# EAGLE schematic JunoCTRL Current (EAGLE 9.2.2)
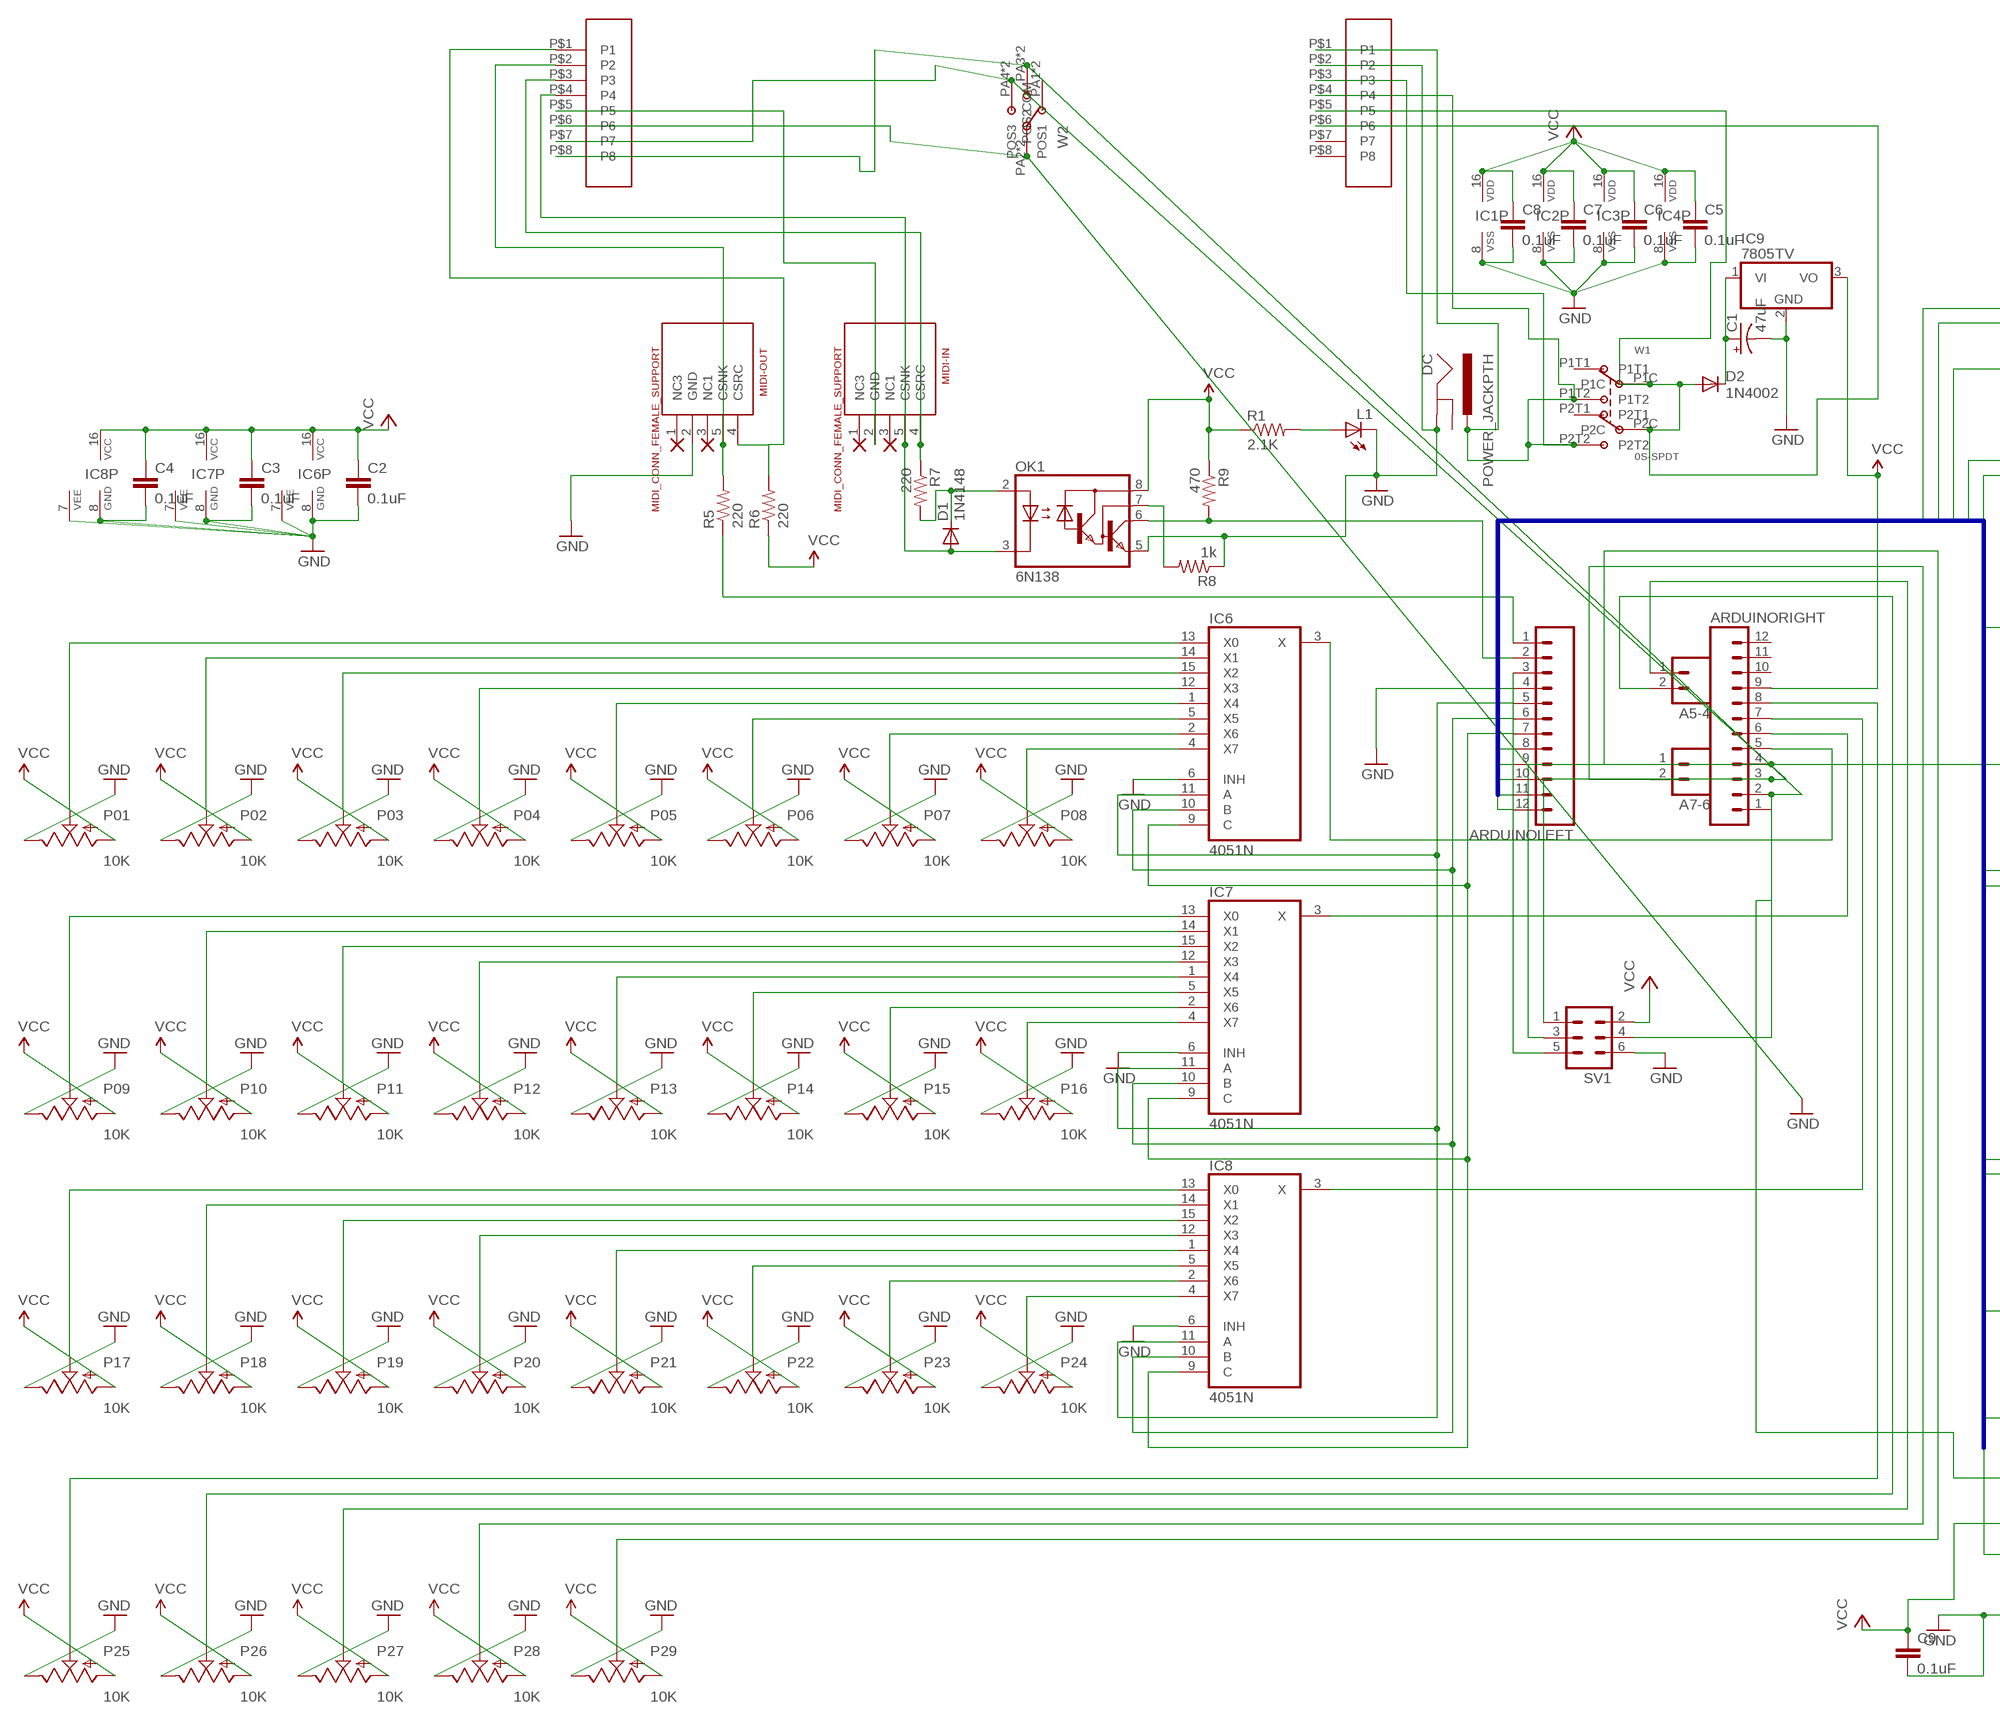
[diagram p0: schematic, sheet 1, part 1 of 2]
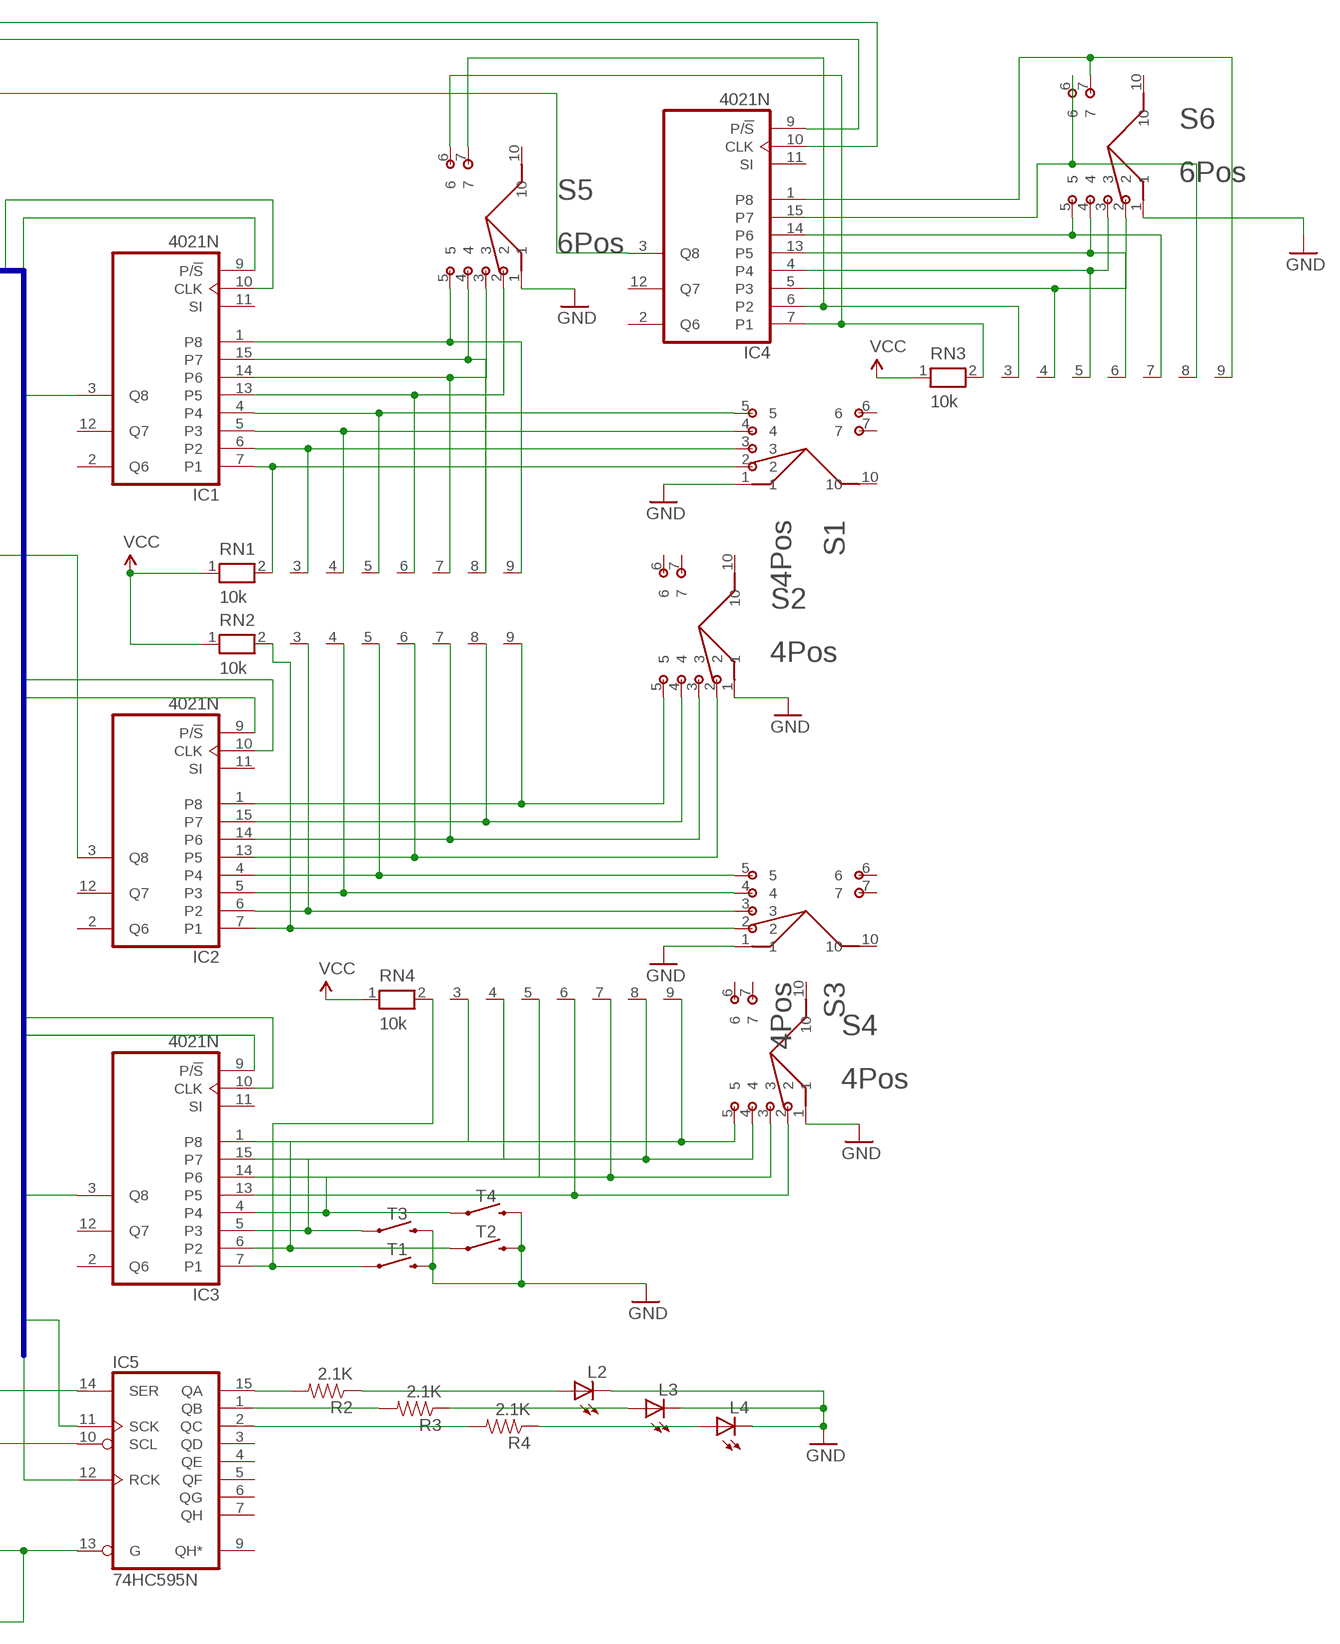
[diagram p1: schematic, sheet 1, part 2 of 2]

## Parts
A5-4  M02PTH  [1X02]
A7-6  M02PTH  [1X02]
ARDUINOLEFT  M12PTH  [1X12]
ARDUINORIGHT  M12PTH  [1X12]
C1  47uF  CAP_POLPTH1  [CPOL-RADIAL-100UF-25V]
C2  0.1uF  CAPPTH  [CAP-PTH-SMALL]
C3  0.1uF  CAPPTH  [CAP-PTH-SMALL]
C4  0.1uF  CAPPTH  [CAP-PTH-SMALL]
C5  0.1uF  CAPPTH  [CAP-PTH-SMALL]
C6  0.1uF  CAPPTH  [CAP-PTH-SMALL]
C7  0.1uF  CAPPTH  [CAP-PTH-SMALL]
C8  0.1uF  CAPPTH  [CAP-PTH-SMALL]
C9  0.1uF  CAPPTH  [CAP-PTH-SMALL]
D1  1N4148  1N4148DO35-7  [DO35-7]
D2  1N4002  1N4004  [DO41-7]
DC  POWER_JACKPTH  [POWER_JACK_PTH]
IC1  4021N  [DIL16]
IC2  4021N  [DIL16]
IC3  4021N  [DIL16]
IC4  4021N  [DIL16]
IC5  74HC595N  [DIL16]
IC6  4051N  [DIL16]
IC7  4051N  [DIL16]
IC8  4051N  [DIL16]
IC9  7805TV  [TO220V]
L1  LED3MM  [LED3MM]
L2  LED3MM  [LED3MM]
L3  LED3MM  [LED3MM]
L4  LED3MM  [LED3MM]
MIDI-IN  MIDI_CONN_FEMALE_SUPPORT  [DIN_5_FEMALE_SUPPORT]
MIDI-OUT  MIDI_CONN_FEMALE_SUPPORT  [DIN_5_FEMALE_SUPPORT]
OK1  6N138  [DIL08]
P01  10K  POT  [ALPS_POT]
P02  10K  POT  [ALPS_POT]
P03  10K  POT  [ALPS_POT]
P04  10K  POT  [ALPS_POT]
P05  10K  POT  [ALPS_POT]
P06  10K  POT  [ALPS_POT]
P07  10K  POT  [ALPS_POT]
P08  10K  POT  [ALPS_POT]
P09  10K  POT  [ALPS_POT]
P10  10K  POT  [ALPS_POT]
P11  10K  POT  [ALPS_POT]
P12  10K  POT  [ALPS_POT]
P13  10K  POT  [ALPS_POT]
P14  10K  POT  [ALPS_POT]
P15  10K  POT  [ALPS_POT]
P16  10K  POT  [ALPS_POT]
P17  10K  POT  [ALPS_POT]
P18  10K  POT  [ALPS_POT]
P19  10K  POT  [ALPS_POT]
P20  10K  POT  [ALPS_POT]
P21  10K  POT  [ALPS_POT]
P22  10K  POT  [ALPS_POT]
P23  10K  POT  [ALPS_POT]
P24  10K  POT  [ALPS_POT]
P25  10K  POT  [ALPS_POT]
P26  10K  POT  [ALPS_POT]
P27  10K  POT  [ALPS_POT]
P28  10K  POT  [ALPS_POT]
P29  10K  POT  [ALPS_POT]
R1  2.1K  RESISTORAXIAL-0.3  [AXIAL-0.3]
R2  2.1K  RESISTORAXIAL-0.3  [AXIAL-0.3]
R3  2.1K  RESISTORAXIAL-0.3  [AXIAL-0.3]
R4  2.1K  RESISTORAXIAL-0.3  [AXIAL-0.3]
R5  220  RESISTORAXIAL-0.3  [AXIAL-0.3]
R6  220  RESISTORAXIAL-0.3  [AXIAL-0.3]
R7  220  RESISTORAXIAL-0.3  [AXIAL-0.3]
R8  1k  RESISTORAXIAL-0.3  [AXIAL-0.3]
R9  470  RESISTORAXIAL-0.3  [AXIAL-0.3]
RN1  10k  RN08  [RN-9]
RN2  10k  RN08  [RN-9]
RN3  10k  RN08  [RN-9]
RN4  10k  RN08  [RN-9]
S1  4Pos  SRBV  [SRBV]
S2  4Pos  SRBV  [SRBV]
S3  4Pos  SRBV  [SRBV]
S4  4Pos  SRBV  [SRBV]
S5  6Pos  SRBV  [SRBV]
S6  6Pos  SRBV  [SRBV]
SV1  MA03-2  [MA03-2]
T1  TACTSWITCH  [TACTILE-PTH-12MM]
T2  TACTSWITCH  [TACTILE-PTH-12MM]
T3  TACTSWITCH  [TACTILE-PTH-12MM]
T4  TACTSWITCH  [TACTILE-PTH-12MM]
U$1  JSTCUSTOM_JST_PH8THROUGH_HOLE  [JSTCUSTOM_JST_PH8]
U$2  JSTCUSTOM_JST_PH8THROUGH_HOLE  [JSTCUSTOM_JST_PH8]
W1  0S-SPDT  [0S-SPDT]
W2  0S-SP3T  [0S-SP3T]

## Nets
GND: ARDUINOLEFT.4 C1.2(-) C2.2 C3.2 C4.2 C5.2 C6.2 C7.2 C8.2 C9.2 DC.GND IC1.8(VSS) IC2.8(VSS) IC3.8(VSS) IC4.8(VSS) IC5.13(G) IC6.6(INH) IC6.7(VEE) IC6.8(GND) IC7.6(INH) IC7.7(VEE) IC7.8(GND) IC8.6(INH) IC8.7(VEE) IC8.8(GND) IC9.2(GND) L1.K(C) L2.K(C) L3.K(C) L4.K(C) MIDI-OUT.2(GND) OK1.5(GND) P01.P$1(E) P02.P$1(E) P03.P$1(E) P04.P$1(E) P05.P$1(E) P06.P$1(E) P07.P$1(E) P08.P$1(E) P09.P$1(E) P10.P$1(E) P11.P$1(E) P12.P$1(E) P13.P$1(E) P14.P$1(E) P15.P$1(E) P16.P$1(E) P17.P$1(E) P18.P$1(E) P19.P$1(E) P20.P$1(E) P21.P$1(E) P22.P$1(E) P23.P$1(E) P24.P$1(E) P25.P$1(E) P26.P$1(E) P27.P$1(E) P28.P$1(E) P29.P$1(E) R8.P$1 S1.1 S2.1 S3.1 S4.1 S5.1 S6.1 SV1.6 T1.1 T2.1 T3.1 T4.1 U$1.P$6(P6) U$2.P$2(P2) W2.PA2(COM) W2.PA6(COM)
N$1: IC7.4(X7) P16.P$2(S)
N$2: IC6.4(X7) P08.P$2(S)
N$3: IC6.2(X6) P07.P$2(S)
N$4: IC6.5(X5) P06.P$2(S)
N$5: IC6.1(X4) P05.P$2(S)
N$6: IC6.12(X3) P04.P$2(S)
N$7: IC6.15(X2) P03.P$2(S)
N$8: IC6.14(X1) P02.P$2(S)
N$9: IC6.13(X0) P01.P$2(S)
N$10: IC7.2(X6) P15.P$2(S)
N$11: IC7.5(X5) P14.P$2(S)
N$12: IC7.1(X4) P13.P$2(S)
N$13: IC7.12(X3) P12.P$2(S)
N$14: IC7.15(X2) P11.P$2(S)
N$15: IC7.14(X1) P10.P$2(S)
N$16: IC7.13(X0) P09.P$2(S)
N$17: IC8.4(X7) P24.P$2(S)
N$18: IC8.2(X6) P23.P$2(S)
N$19: IC8.5(X5) P22.P$2(S)
N$20: IC8.1(X4) P21.P$2(S)
N$21: IC8.12(X3) P20.P$2(S)
N$22: IC8.15(X2) P19.P$2(S)
N$23: IC8.14(X1) P18.P$2(S)
N$24: IC8.13(X0) P17.P$2(S)
N$25: ARDUINORIGHT.8 P25.P$2(S)
N$26: A5-4.2 P26.P$2(S)
N$27: A5-4.1 P27.P$2(S)
N$28: A7-6.2 P28.P$2(S)
N$29: A7-6.1 P29.P$2(S)
N$30: ARDUINOLEFT.5 IC6.11(A) IC7.11(A) IC8.11(A)
N$31: ARDUINOLEFT.6 IC6.10(B) IC7.10(B) IC8.10(B)
N$32: ARDUINOLEFT.7 IC6.9(C) IC7.9(C) IC8.9(C)
N$33: ARDUINORIGHT.5 IC6.3(X)
N$34: ARDUINORIGHT.6 IC7.3(X)
N$35: ARDUINORIGHT.7 IC8.3(X)
N$36: IC1.7(P1) RN1.2 S1.2
N$37: IC1.6(P2) RN1.3 S1.3
N$38: IC1.5(P3) RN1.4 S1.4
N$39: IC1.4 RN1.5 S1.5
N$40: IC1.13(P5) RN1.6 S5.2
N$41: IC1.14(P6) RN1.7 S5.3
N$42: IC1.15(P7) RN1.8 S5.4
N$43: IC1.1(P8) RN1.9 S5.5
N$44: IC2.7(P1) RN2.2 S3.2
N$45: IC2.6(P2) RN2.3 S3.3
N$46: IC2.5(P3) RN2.4 S3.4
N$47: IC2.4 RN2.5 S3.5
N$48: IC2.13(P5) RN2.6 S2.2
N$49: IC2.14(P6) RN2.7 S2.3
N$50: IC2.15(P7) RN2.8 S2.4
N$51: IC2.1(P8) RN2.9 S2.5
N$52: OK1.7(VB) R8.P$2
N$53: IC4.7(P1) RN3.2 S5.6
N$54: IC4.6(P2) RN3.3 S5.7
N$55: IC4.5(P3) RN3.4 S6.2
N$56: IC4.4 RN3.5 S6.3
N$57: IC4.13(P5) RN3.6 S6.4
N$58: D2.A U$2.P$5(P5) U$2.P$6(P6) W1.P1C W1.P2C
N$59: IC4.14(P6) RN3.7 S6.5
N$60: IC4.15(P7) RN3.8 S6.6
N$62: L1.A R1.P$2
N$63: ARDUINORIGHT.2 SV1.4 U$1.P$8(P8) W2.PA3(POS2) W2.PA7(POS2)
N$64: IC5.15(QA) R2.P$2
N$65: L2.A R2.P$1
N$66: ARDUINORIGHT.1 IC5.14(SER)
N$68: L3.A R3.P$1
N$69: ARDUINORIGHT.4 IC2.3(Q8) SV1.3
N$70: DC.PWR U$2.P$1(P1) U$2.P$3(P3) U$2.P$4(P4) W1.P1T2 W1.P2T2
N$71: D1.A MIDI-IN.5(CSNK) OK1.3(C) U$1.P$4(P4)
N$72: C1.1(+) D2.C IC9.1(VI)
N$73: ARDUINOLEFT.2 OK1.6(VO) R9.P$2
N$74: MIDI-OUT.5(CSNK) R5.P$2 U$1.P$2(P2)
N$75: ARDUINOLEFT.1 R5.P$1
N$76: MIDI-OUT.4(CSRC) R6.P$2
N$77: IC4.1(P8) RN3.9 S6.7
N$78: IC3.7(P1) RN4.2 T1.3
N$79: IC3.6(P2) RN4.3 T2.3
N$80: IC3.5(P3) RN4.4 T3.3
N$81: IC3.4 RN4.5 T4.3
N$82: IC5.1(QB) R3.P$2
N$83: IC5.2(QC) R4.P$2
N$84: L4.A R4.P$1
N$85: D1.C OK1.2(A) R7.P$2
N$86: IC3.13(P5) RN4.6 S4.2
N$87: IC3.14(P6) RN4.7 S4.3
N$88: IC3.15(P7) RN4.8 S4.4
N$89: IC3.1(P8) RN4.9 S4.5
N$90: ARDUINOLEFT.3 SV1.5
N$91: U$1.P$1(P1)
N$92: MIDI-IN.2(GND) U$1.P$5(P5)
N$93: MIDI-IN.4(CSRC) R7.P$1 U$1.P$3(P3)
N$94: ARDUINORIGHT.3 SV1.1 U$1.P$7(P7) W2.PA4(POS3) W2.PA8(POS3)
SR5: ARDUINOLEFT.8 IC1.3(Q8)
SR6: ARDUINOLEFT.9 IC1.9(P/!S) IC2.9(P/!S) IC3.9(P/!S) IC4.9(P/!S) IC5.12(RCK)
SR7: ARDUINOLEFT.10 IC1.10(CLK) IC2.10(CLK) IC3.10(CLK) IC4.10(CLK) IC5.11(SCK)
SR8: ARDUINOLEFT.11 IC3.3(Q8)
SR9: ARDUINOLEFT.12 IC4.3(Q8)
VCC: ARDUINORIGHT.9 C2.1 C3.1 C4.1 C5.1 C6.1 C7.1 C8.1 C9.1 IC1.16(VDD) IC2.16(VDD) IC3.16(VDD) IC4.16(VDD) IC5.10(SCL) IC6.16(VCC) IC7.16(VCC) IC8.16(VCC) IC9.3(VO) OK1.8(VCC) P01.P$3(A) P02.P$3(A) P03.P$3(A) P04.P$3(A) P05.P$3(A) P06.P$3(A) P07.P$3(A) P08.P$3(A) P09.P$3(A) P10.P$3(A) P11.P$3(A) P12.P$3(A) P13.P$3(A) P14.P$3(A) P15.P$3(A) P16.P$3(A) P17.P$3(A) P18.P$3(A) P19.P$3(A) P20.P$3(A) P21.P$3(A) P22.P$3(A) P23.P$3(A) P24.P$3(A) P25.P$3(A) P26.P$3(A) P27.P$3(A) P28.P$3(A) P29.P$3(A) R1.P$1 R6.P$1 R9.P$1 RN1.1 RN2.1 RN3.1 RN4.1 SV1.2
Unconnected: ARDUINORIGHT.10 ARDUINORIGHT.11 ARDUINORIGHT.12 DC.GNDBREAK IC1.2(Q6) IC1.11(SI) IC1.12(Q7) IC2.2(Q6) IC2.11(SI) IC2.12(Q7) IC3.2(Q6) IC3.11(SI) IC3.12(Q7) IC4.2(Q6) IC4.11(SI) IC4.12(Q7) IC5.3(QD) IC5.4(QE) IC5.5(QF) IC5.6(QG) IC5.7(QH) IC5.9(QH*) MIDI-IN.1(NC3) MIDI-IN.3(NC1) MIDI-OUT.1(NC3) MIDI-OUT.3(NC1) S1.6 S1.7 S1.10 S2.6 S2.7 S2.10 S3.6 S3.7 S3.10 S4.6 S4.7 S4.10 S5.10 S6.10 U$2.P$7(P7) U$2.P$8(P8) W1.P1T1 W1.P2T1 W2.PA1(POS1) W2.PA5(POS1)

## Buses
SR[5..9]

## Power pins joined to a net without a drawn wire
GND: IC5.8(GND)
VCC: IC5.16(VCC)

## Library data of the parts
A5-4 A7-6 = SparkFun-Connectors:M02: Standard 2-pin 0.1" header. Use with - straight break away headers ( PRT-00116) - right angle break away headers (PRT-00553) - swiss pins (PRT-00743) - machine pins (PRT-00117) - female headers (PRT-00115) Molex polarized connector foot print use with: PRT-08233 with associated crimp pins and housings. 2.54_SCREWTERM for use with PRT-10571. 3.5mm Screw Terminal footprints for PRT-08084 5mm Screw Terminal footprints for use with PRT-08432
ARDUINOLEFT ARDUINORIGHT = SparkFun-Connectors:M12: Header 12 Standard 12-pin 0.1" header. Use with straight break away headers (SKU : PRT-00116), right angle break away headers (PRT-00553), swiss pins (PRT-00743), machine pins (PRT-00117), and female headers (PRT-00115).
C1 = SparkFun-Passives:CAP_POL: Capacitor Polarized These are standard SMD and PTH capacitors. Normally 10uF, 47uF, and 100uF in electrolytic and tantalum varieties. Always verify the external diameter of the through hole cap, it varies with capacity, voltage, and manufacturer. The EIA devices should be standard.
C2-C9 = SparkFun-Passives:CAP: Capacitor Standard 0603 ceramic capacitor, and 0.1" leaded capacitor.
D1 = diode:1N4148: DIODE high speed (Philips)
D2 = diode:1N4004: DIODE general purpose rectifier, 1 A
DC = SparkFun-Connectors:POWER_JACK: Power Jack This is the standard 5.5mm barrel jack for power. The PTH is the most common, proven, reliable, footprint. The Slot footprint only works if the mill layer is transmitted to the PCB fab house so be warned. Mating wall wart : TOL-00298 (and others); PROD_ID: CONN-08197
IC1-IC4 = 40xx:4021: 8-bit static SHIFT REGISTER
IC5 = 74xx-eu:74*595: 8-bit SHIFT REGISTER, output latch
IC6-IC8 = 40xx:4051: 8-channel ANALOG MULTIPLEXER
IC9 = linear:78*: Positive VOLTAGE REGULATOR Source: http://cache.national.com/ds/LM/LM78L05.pdf http://www.fairchildsemi.com/ds/LM/LM7805.pdf
L1-L4 = led:LED: LED OSRAM: - CHIPLED LG R971, LG N971, LY N971, LG Q971, LY Q971, LO R971, LY R971 LH N974, LH R974 LS Q976, LO Q976, LY Q976 LO Q996 - Hyper CHIPLED LW Q18S LB Q993, LB Q99A, LB R99A - SideLED LS A670, LO A670, LY A670, LG A670, LP A670 LB A673, LV A673, LT A673, LW A673 LH A674 LY A675 LS A676, LA A676, LO A676, LY A676, LW A676 LS A679, LY A679, LG A679 - Hyper Micro SIDELED® LS Y876, LA Y876, LO Y876, LY Y876 LT Y87S - SmartLED LW L88C, LW L88S LB L89C, LB L89S, LG L890 LS L89K, LO L89K, LY L89K LS L896, LA L896, LO L896, LY L896 - TOPLED LS T670, LO T670, LY T670, LG T670, LP T670 LSG T670, LSP T670, LSY T670, LOP T670, LYG T670 LG T671, LOG T671, LSG T671 LB T673, LV T673, LT T673, LW T673 LH T674 LS T676, LA T676, LO T676, LY T676, LB T676, LH T676, LSB T676, LW T676 LB T67C, LV T67C, LT T67C, LS T67K, LO T67K, LY T67K, LW E67C LS E67B, LA E67B, LO E67B, LY E67B, LB E67C, LV E67C, LT E67C LW T67C LS T679, LY T679, LG T679 LS T770, LO T770, LY T770, LG T770, LP T770 LB T773, LV T773, LT T773, LW T773 LH T774 LS E675, LA E675, LY E675, LS T675 LS T776, LA T776, LO T776, LY T776, LB T776 LHGB T686 LT T68C, LB T68C - Hyper Mini TOPLED® LB M676 - Mini TOPLED Santana® LG M470 LS M47K, LO M47K, LY M47K Source: http://www.osram.convergy.de LUXEON: - LUMILED® LXK2-PW12-R00, LXK2-PW12-S00, LXK2-PW14-U00, LXK2-PW14-V00 LXK2-PM12-R00, LXK2-PM12-S00, LXK2-PM14-U00 LXK2-PE12-Q00, LXK2-PE12-R00, LXK2-PE12-S00, LXK2-PE14-T00, LXK2-PE14-U00 LXK2-PB12-K00, LXK2-PB12-L00, LXK2-PB12-M00, LXK2-PB14-N00, LXK2-PB14-P00, LXK2-PB14-Q00 LXK2-PR12-L00, LXK2-PR12-M00, LXK2-PR14-Q00, LXK2-PR14-R00 LXK2-PD12-Q00, LXK2-PD12-R00, LXK2-PD12-S00 LXK2-PH12-R00, LXK2-PH12-S00 LXK2-PL12-P00, LXK2-PL12-Q00, LXK2-PL12-R00 Source: www.luxeon.com KINGBRIGHT: KA-3528ASYC Source: www.kingbright.com
MIDI-IN MIDI-OUT = SparkFun-Connectors:MIDI_CONN_FEMALE_SUPPORT: MIDI connector with strain relief (DIN-5 female)
OK1 = optocoupler:6N138: MOTOROLA OPTO COUPLER; MF: VISHAY/TELEFUNKEN; MPN: 6N138; OC_FARNELL: 9860150; OC_NEWARK: 35K5294
P01-P09 P10-P29 = SparkFun-Electromechanical:POT
R1-R9 = SparkFun-Passives:RESISTOR: Resistor Basic schematic elements and footprints for 0603, 1206, and PTH resistors.
RN1-RN4 = resistor-net:RN08: RESISTOR NETWORK; OC_FARNELL: unknown; OC_NEWARK: unknown
S1-S6 = JunoLib:SRBV: ALPS SRBV Switch
SV1 = con-lstb:MA03-2: PIN HEADER; OC_FARNELL: unknown; OC_NEWARK: unknown
T1-T4 = JunoLib:TACTSWITCH: Tact Momentary Switch Button device we use for the JunoCTRL.
U$1 U$2 = BackPanelBoard:JSTCUSTOM_JST_PH8
W1 = JunoLib:0S-SPDT: E-Switch EG 2208A DPDT Switch
W2 = JunoLib:0S-SP3T: E-Switch EG2310 DP3T